# Altium schematic sheet CLK_SW.SchDoc
size A; SheetNumber: 3; SheetTotal: 3
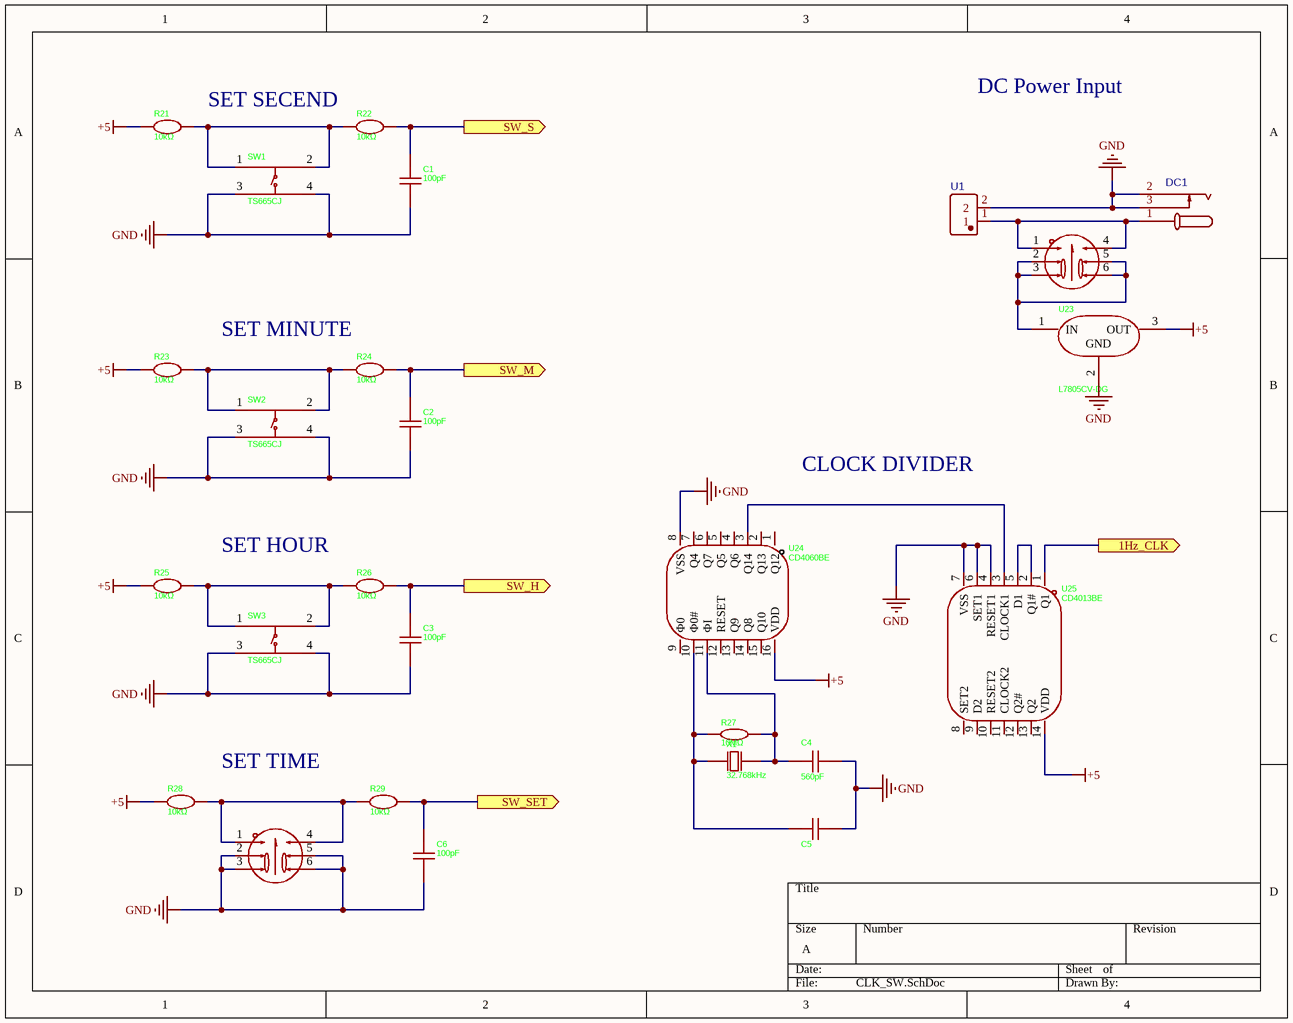
[diagram p0: CLK_SW.SchDoc]

## Parts
C1  100pF  [CAP-TH_L5.0-W3.0-P5.00-D0.6-S2.45]
C2  100pF  [CAP-TH_L5.0-W3.0-P5.00-D0.6-S2.45]
C3  100pF  [CAP-TH_L5.0-W3.0-P5.00-D0.6-S2.45]
C4  560pF  [CAP-TH_L8.5-W3.0-P5.00-D0.6-S2.5]
C5  22pF  [CAP-TH_L7.4-W4.0-P6.40-D0.5-S1.00]  (value not drawn)
C6  100pF  [CAP-TH_L5.0-W3.0-P5.00-D0.6-S2.45]
DC1  DC-005-2.5A-2.0  [CONN-TH_DC-005-2.5A-2.0]  (value not drawn)
R21  10kΩ  [RES-TH_BD2.4-L6.3-P10.30-D0.6]
R22  10kΩ  [RES-TH_BD2.4-L6.3-P10.30-D0.6]
R23  10kΩ  [RES-TH_BD2.4-L6.3-P10.30-D0.6]
R24  10kΩ  [RES-TH_BD2.4-L6.3-P10.30-D0.6]
R25  10kΩ  [RES-TH_BD2.4-L6.3-P10.30-D0.6]
R26  10kΩ  [RES-TH_BD2.4-L6.3-P10.30-D0.6]
R27  10MΩ  [RES-TH_BD2.2-L6.5-P10.50-D0.6]
R28  10kΩ  [RES-TH_BD2.4-L6.3-P10.30-D0.6]
R29  10kΩ  [RES-TH_BD2.4-L6.3-P10.30-D0.6]
SW1  TS665CJ  [SW-TH_4P-L6.0-W6.0-P4.50-LS6.5]
SW2  TS665CJ  [SW-TH_4P-L6.0-W6.0-P4.50-LS6.5]
SW3  TS665CJ  [SW-TH_4P-L6.0-W6.0-P4.50-LS6.5]
U1  DBT50G-7.62-2P  [CONN-TH_2P-P7.62_L15.2-W16.7-EX4.2]  (value not drawn)
U22  PS-7054DVB-6PL  [SW-TH_6P-L7.0-W7.0-P2.00]  (value not drawn)
U23  L7805CV-DG  [TO-220-3_L10.0-W4.5-P2.54-L]
U24  CD4060BE  [DIP-16_L19.8-W6.5-P2.54-LS7.6-BL]
U25  CD4013BE  [DIP-14_L19.2-W6.6-P2.54-LS10.9-BL]
U26  PS-7054DVB-6PL  [SW-TH_6P-L7.0-W7.0-P2.00]  (value not drawn)
X1  32.768kHz  [OSC-TH_BD3.1-P0.8-D0.3]

## Ports
1Hz_CLK (out, see Display_Hour[1B]), SW_H (out, see Display_Hour[2C]), SW_M (out, see Display_Hour[2D]), SW_S (out, see Display_Hour[2C]), SW_SET (out, see Display_Hour[2C])

## Nets
+5: R21.2 R23.2 R25.2 R28.2 U23.3(OUT) U24.16(VDD) U25.14(VDD)
GND: C1.1 C2.1 C3.1 C4.1 C5.1 C6.1 DC1.2 DC1.3 SW1.3(C) SW1.4(D) SW2.3(C) SW2.4(D) SW3.3(C) SW3.4(D) U1.2 U23.2(GND) U24.8(VSS) U25.4(RESET1) U25.6(SET1) U25.7(VSS) U26.2 U26.3 U26.5 U26.6
1Hz_CLK: U25.1(Q1) ; port 1Hz_CLK
SW_H: C3.2 R26.1 ; port SW_H
SW_M: C2.2 R24.1 ; port SW_M
SW_S: C1.2 R22.1 ; port SW_S
SW_SET: C6.2 R29.1 ; port SW_SET
NetC4_2: C4.2 R27.1 U24.11(ΦI) X1.2(OSC2)
NetC5_2: C5.2 R27.2 U24.10(Φ0#) X1.1(OSC1)
NetDC1_1: DC1.1 U1.1 U22.1 U22.4
NetR21_1: R21.1 R22.2 SW1.1(A) SW1.2(B)
NetR23_1: R23.1 R24.2 SW2.1(A) SW2.2(B)
NetR25_1: R25.1 R26.2 SW3.1(A) SW3.2(B)
NetR28_1: R28.1 R29.2 U26.1 U26.4
NetU22_2: U22.2 U22.3 U22.5 U22.6 U23.1(IN)
NetU24_3: U24.3(Q14) U25.3(CLOCK1)
NetU25_2: U25.2(Q1#) U25.5(D1)

Not connected (* = marked no-connect by the designer): U24 1(Q12) 2(Q13) 4(Q6) 5(Q5) 6(Q7) 7(Q4) 9(Φ0) 12(RESET) 13(Q9) 14(Q8) 15(Q10); U25 8(SET2) 9(D2) 10(RESET2) 11(CLOCK2) 12(Q2#) 13(Q2)

## Notes on the sheet
- DC Power Input
- SET SECEND
- SET MINUTE
- CLOCK DIVIDER
- SET HOUR
- (near R28) SET TIME

## Library data of the parts
C1-C3 C6 = Cap_100pF_50V_ceramic: Manufacturer: SHM(南方宏明); Symbol: DCT101K20Y5PF6FJ5A0; Add into BOM: yes; Tolerance: ±10%; Voltage Rating: 50V; Pin Spacing: 5mm; Temperature Coefficient: Y5P; Device: DCT101K20Y5PF6FJ5A0; LCSC Part Name: 100pF ±10% 50V; Supplier Part: C2896026; Manufacturer Part: DCT101K20Y5PF6FJ5A0; Supplier Footprint: 插件,P=5mm; JLCPCB Part Class: Extended Part; Datasheet: https://atta.szlcsc.com/upload/public/pdf/source/20210929/C4FEE90C41821237A84737C21615A4EC.pdf; Supplier: LCSC; Convert to PCB: yes; Value: 100pF
C4 = Cap_560pF_50V_ceraic: Manufacturer: SHM(南方宏明); Symbol: DCC561J34SL F6FJ5A0; Add into BOM: yes; Tolerance: ±5%; Voltage Rating: 50V; Pin Spacing: 5mm; Temperature Coefficient: SL; Device: DCC561J34SL F6FJ5A0; LCSC Part Name: 560pF ±5% 50V; Supplier Part: C2896138; Manufacturer Part: DCC561J34SL F6FJ5A0; Supplier Footprint: 插件,P=5mm; JLCPCB Part Class: Extended Part; Datasheet: https://atta.szlcsc.com/upload/public/pdf/source/20210929/2675BE423E96B4772DBF330AE545E239.pdf; Supplier: LCSC; Convert to PCB: yes; Value: 560pF
C5 = Cap_22pF_50V_ceramic: Manufacturer: Dersonic(德尔创); Symbol: CC1H220KA1EDCH4B1100; Add into BOM: yes; Tolerance: ±10%; Voltage Rating: 50V; Pin Spacing: 2.54mm; Temperature Coefficient: NP0; Body Thickness: 2.4mm; Device: CC1H220KA1EDCH4B1100; LCSC Part Name: 22pF ±10% 50V; Supplier Part: C2832510; Manufacturer Part: CC1H220KA1EDCH4B1100; Supplier Footprint: 插件,P=2.54mm; JLCPCB Part Class: Extended Part; Datasheet: https://atta.szlcsc.com/upload/public/pdf/source/20211103/062C09467AB58979163D97626BAD0297.pdf; Supplier: LCSC; Convert to PCB: yes; Value: 22pF; Diameter: 4.8mm
DC1 = DC-005-2.5A-2.0: Manufacturer: XKB Connection(中国星坤); Contributor: LCSC; Supplier: LCSC; Supplier Part: C319099; Manufacturer Part: DC-005-2.5A-2.0; JLCPCB Part Class: Extended Part; spicePre: D; spiceSymbolName: DC-005-2.5A-2.0
R21-R26 R28 R29 = Reg_10k_0.25W: Manufacturer: Tyohm(幸亚电阻); Symbol: RN 1/4W 10K F T/B A1; Device: RN1/4W10KFT/BA1; Add into BOM: yes; Tolerance: ±1%; Overload Voltage (Max): 250V; Power(Watts): 250mW; Temperature Coefficient: ±50ppm/℃; LCSC Part Name: 10kΩ ±1% 250mW 金属膜电阻; Supplier Part: C410695; Manufacturer Part: RN1/4W10KFT/BA1; Supplier Footprint: 插件,D2.4xL6.5mm; JLCPCB Part Class: Extended Part; Datasheet: https://atta.szlcsc.com/upload/public/pdf/source/20190808/C410699_D126E64D28B638F1D73B58E9F61DFD9B.pdf; Supplier: LCSC; Convert to PCB: yes; Type: Metal Film Resistors; Value: 10kΩ; Operating Temperature Range: -55℃~+125℃
R27 = Reg_10M_0.25W: Manufacturer: CCO(千志电子); Symbol: CF1/4W-10MΩ±5%; Device: CF1/4W-10MΩ±5% T; Add into BOM: yes; Tolerance: ±5%; Voltage-Supply(Max): 250V; Power(Watts): 250mW; Temperature Coefficient: -1500ppm/℃~0ppm/℃; LCSC Part Name: 10MΩ ±5% 250mW 碳膜电阻; Supplier Part: C127261; Manufacturer Part: CF1/4W-10MΩ±5% T; Supplier Footprint: 插件,D2.3xL6.5mm; JLCPCB Part Class: Extended Part; Datasheet: https://atta.szlcsc.com/upload/public/pdf/source/20190910/C427328_A0A2D65F3FD547937F4E674C90868175.pdf; Supplier: LCSC; Convert to PCB: yes; Type: Carbon Resister; Value: 10MΩ; Operating Temperature: -55℃~+155℃
SW1-SW3 = TS665CJ: Manufacturer: SHOU HAN(首韩); Add into BOM: yes; Circuit: SPST; Actuator Style: Round Button; Switch Length: 6mm; Switch Height: 5mm; Contact Current: 50mA; Voltage Rating (DC): 12V; Symbol: TS665CJ; Device: TS665CJ; LCSC Part Name: 6*6*5mm 直插 轻触开关; Supplier Part: C393938; Manufacturer Part: TS665CJ; Supplier Footprint: 插件; JLCPCB Part Class: Extended Part; Datasheet: https://atta.szlcsc.com/upload/public/pdf/source/20190521/C393938_BDABEAC600B4C55E200A80AA129B70BC.pdf; Supplier: LCSC; Convert to PCB: yes; Mounting Style: Straight; Switch Width: 6mm; With Lamp: -; Mechanical Life: -
U1 = DBT50G-7.62-2P: Manufacturer: DORABO(地博电气); Manufacturer Part: DBT50G-7.62-2P-BK-P; Contributor: LCSC; Supplier: LCSC; Supplier Part: C496127; JLCPCB Part Class: Extended Part; spicePre: U; spiceSymbolName: DBT50G-7.62-2P
U22 U26 = PS-7054DVB-6PL: Manufacturer: G-Switch(品赞); Add into BOM: yes; Self Lock / No Lock: LATCHING; Operating Force: 250gf; Symbol: PS-7054DVB-6PL; Device: PS-7054DVB-6PL; LCSC Part Name: 7*7自锁按键开关; Supplier Part: C22363819; Manufacturer Part: PS-7054DVB-6PL; Supplier Footprint: 插件-6P,7x7mm; JLCPCB Part Class: Extended Part; Datasheet: https://atta.szlcsc.com/upload/public/pdf/source/20240319/F2B7FB2723231C6F1D5F9BB35EBA5342.pdf; Supplier: LCSC; Convert to PCB: yes
U23 = L7805CV-DG: Manufacturer: ST(意法半导体); Add into BOM: yes; Output Type: Fixed; Maximum Input Voltage: 35V; Output Voltage: 5V; Output Current: 1.5A; Power Supply Rejection Ratio (PSRR): 62dB@(120Hz); Dropout Voltage: 2V@(1A); standby current: 8mA; Output Polarity: Positive electrode; Number of Outputs: 1; Symbol: L7805CV-DG; Device: L7805CV-DG; LCSC Part Name: 正稳压器IC; Supplier Part: C3795; Manufacturer Part: L7805CV-DG; Supplier Footprint: TO-220; JLCPCB Part Class: Extended Part; Datasheet: https://atta.szlcsc.com/upload/public/pdf/source/20140724/1457707163191.pdf; Supplier: LCSC; Convert to PCB: yes; Feature: Short-Circuit  Protection；Thermal Protection(TSD)；Overcurrent Protection(OCP); Operating Temperature: 0℃~+125℃
U24 = CD4060BE: Manufacturer: HGSEMI(华冠); Symbol: CD4060BE_C507159; Add into BOM: yes; Device: CD4060BE; LCSC Part Name: CMOS 14 级纹波进位二进制计数器/除法器和振荡器; Supplier Part: C507159; Manufacturer Part: CD4060BE; Supplier Footprint: DIP-16; JLCPCB Part Class: Extended Part; Datasheet: https://atta.szlcsc.com/upload/public/pdf/source/20200730/C507159_CD40804D6EEA04930EB86D9D2459BFCA.pdf; Supplier: LCSC; Convert to PCB: yes
U25 = CD4013BE: Manufacturer: TI(德州仪器); Add into BOM: yes; Trigger Type: Rising Edge; Voltage - Supply: 3V~18V; Clock Frequency: 24MHz; Function: Positioning and resetting; Number of Elements: 2; Number of Bits per Element: 1; Output Type: Complementary Type; Propagation Delay: 90ns@15V,50pF; Current - Output Low(IOL): 6.8mA; Quiescent Current: 4uA; Input Capacitance: 5pF; Symbol: CD4013BE; Device: CD4013BE; LCSC Part Name: CD4013BE; Supplier Part: C5199; Manufacturer Part: CD4013BE; Supplier Footprint: DIP-14; JLCPCB Part Class: Extended Part; Datasheet: https://www.ti.com/cn/lit/gpn/cd4013b; Supplier: LCSC; Convert to PCB: yes; Type: D-Type; Series: 4000BSeries; Current - Output High(IOH): 6.8mA; Operating Temperature: -55℃~+125℃
X1 = AB38T-32.768KHZ: Manufacturer: ABRACON; Add into BOM: yes; Normal temperature Frequency Tolerance: ±20ppm; Equivalent Series Resistance (ESR): 30kΩ; Symbol: AB38T-32.768KHZ; Device: AB38T-32.768KHZ; LCSC Part Name: 32.768kHz ±20ppm 12.5pF; Supplier Part: C194002; Manufacturer Part: AB38T-32.768KHZ; Supplier Footprint: DT-38; JLCPCB Part Class: Extended Part; Datasheet: https://atta.szlcsc.com/upload/public/pdf/source/20180613/C194002_28532E064E51A8E79CA51D5C8B24387E.pdf; Supplier: LCSC; Convert to PCB: yes; Crystal Type: -; Value: 32.768kHz; Frequency Stability(Full temperature range): -